# Altium schematic sheet Vsense.SchDoc
size A
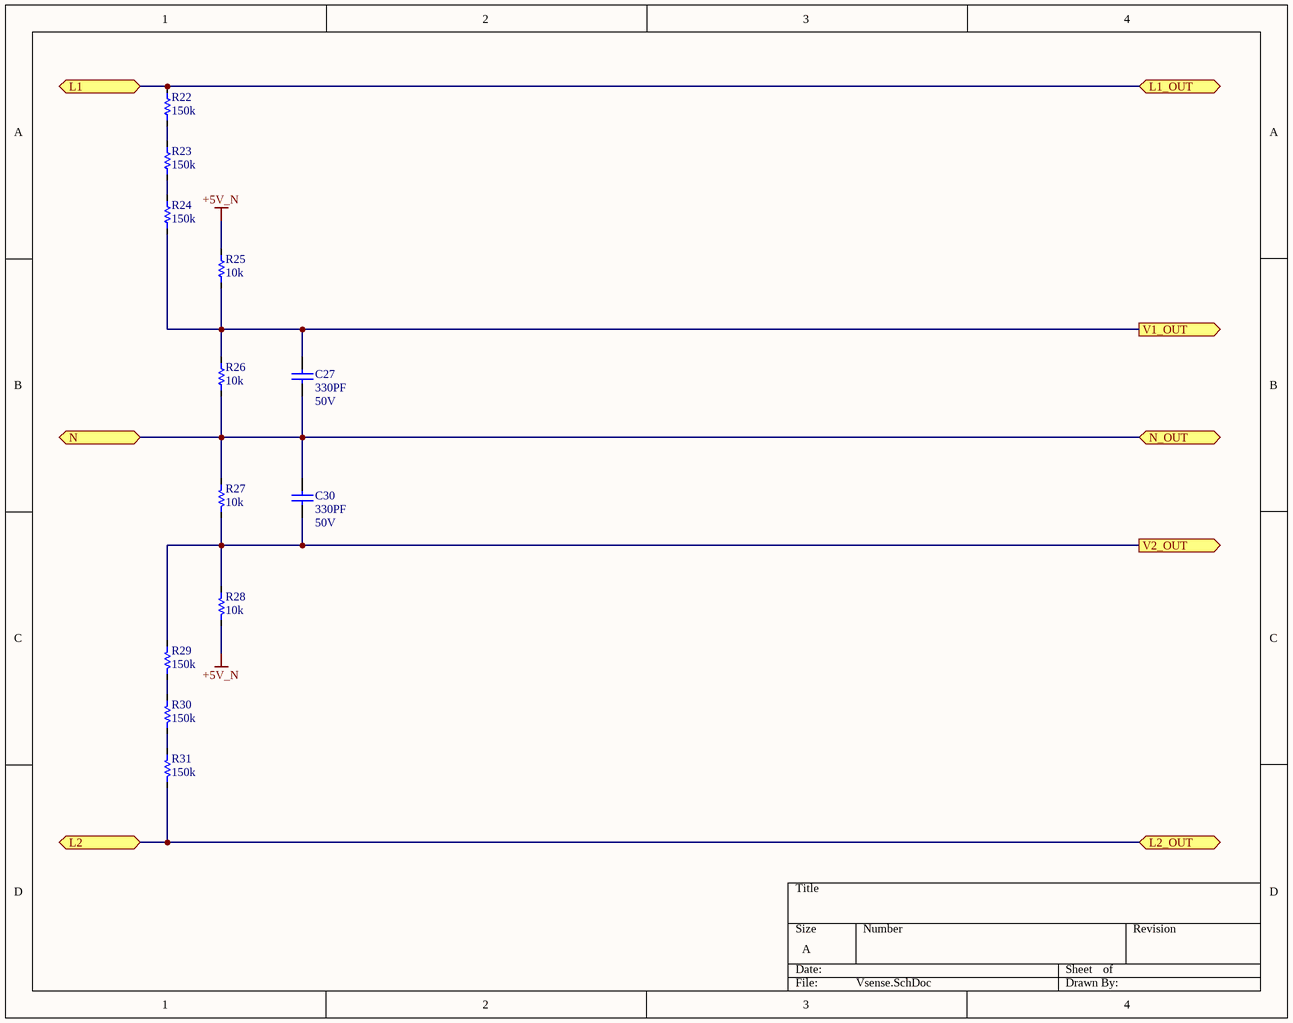
[diagram p0: Vsense.SchDoc]

## Parts
C27  Capacitance: 330PF  Voltage - Rated: 50V  [CAPC1608X08N]  (hidden comment: GRM188R71H331KA01D)
C30  Capacitance: 330PF  Voltage - Rated: 50V  [CAPC1608X08N]  (hidden comment: GRM188R71H331KA01D)
R22  Resistance: 150k  [RESC2012X06N]  (hidden comment: RC0805FR-07150KL)
R23  Resistance: 150k  [RESC2012X06N]  (hidden comment: RC0805FR-07150KL)
R24  Resistance: 150k  [RESC2012X06N]  (hidden comment: RC0805FR-07150KL)
R25  Resistance: 10k  [RESC1608X06N]  (hidden comment: RC0603FR-0710KL)
R26  Resistance: 10k  [RESC1608X06N]  (hidden comment: RC0603FR-0710KL)
R27  Resistance: 10k  [RESC1608X06N]  (hidden comment: RC0603FR-0710KL)
R28  Resistance: 10k  [RESC1608X06N]  (hidden comment: RC0603FR-0710KL)
R29  Resistance: 150k  [RESC2012X06N]  (hidden comment: RC0805FR-07150KL)
R30  Resistance: 150k  [RESC2012X06N]  (hidden comment: RC0805FR-07150KL)
R31  Resistance: 150k  [RESC2012X06N]  (hidden comment: RC0805FR-07150KL)

## Ports
L1 (bidir), L1_OUT (bidir), L2 (bidir), L2_OUT (bidir), N (bidir), N_OUT (bidir), V1_OUT (out), V2_OUT (out)

## Nets
+5V_N: R25.2 R28.2
L1: R22.2 ; port L1, port L1_OUT
L2: R31.2 ; port L2, port L2_OUT
N: C27.1 C30.2 R26.1 R27.1 ; port N, port N_OUT
V1_OUT: C27.2 R24.1 R25.1 R26.2 ; port V1_OUT
V2_OUT: C30.1 R27.2 R28.1 R29.1 ; port V2_OUT
NetR22_1: R22.1 R23.2
NetR23_1: R23.1 R24.2
NetR29_2: R29.2 R30.1
NetR30_2: R30.2 R31.1

## Library data of the parts
C27 C30 = GRM188R71H331KA01D: CAP CER 330PF 50V X7R 0603; Manufacturer: Murata Electronics North America; Manufacturer Part Number: GRM188R71H331KA01D; Supplier 1: Digi-Key; Supplier Part Number 1: 490-1486-1-ND
R22-R24 R29-R31 = RC0805FR-07150KL: RES SMD 150K OHM 1% 1/8W 0805; Manufacturer: Yageo; Manufacturer Part Number: RC0805FR-07150KL; Supplier 1: Digi-Key; Supplier Part Number 1: 311-150KCRCT-ND
R25-R28 = RC0603FR-0710KL: RES SMD 10K OHM 1% 1/10W 0603; Manufacturer: Yageo; Manufacturer Part Number: RC0603FR-0710KL; Supplier 1: Digi-Key; Supplier Part Number 1: 311-10.0KHRCT-ND